# Altium schematic sheet ANALOG_INPUT.SchDoc
size A3; ApprovedBy: D. Grossman; CheckedBy: G. Engel; Author: Y. Yakov; CompanyName: LightSense; DrawnBy: Y. Yakov; Engineer: Y.Yakov; Organization: LightSense
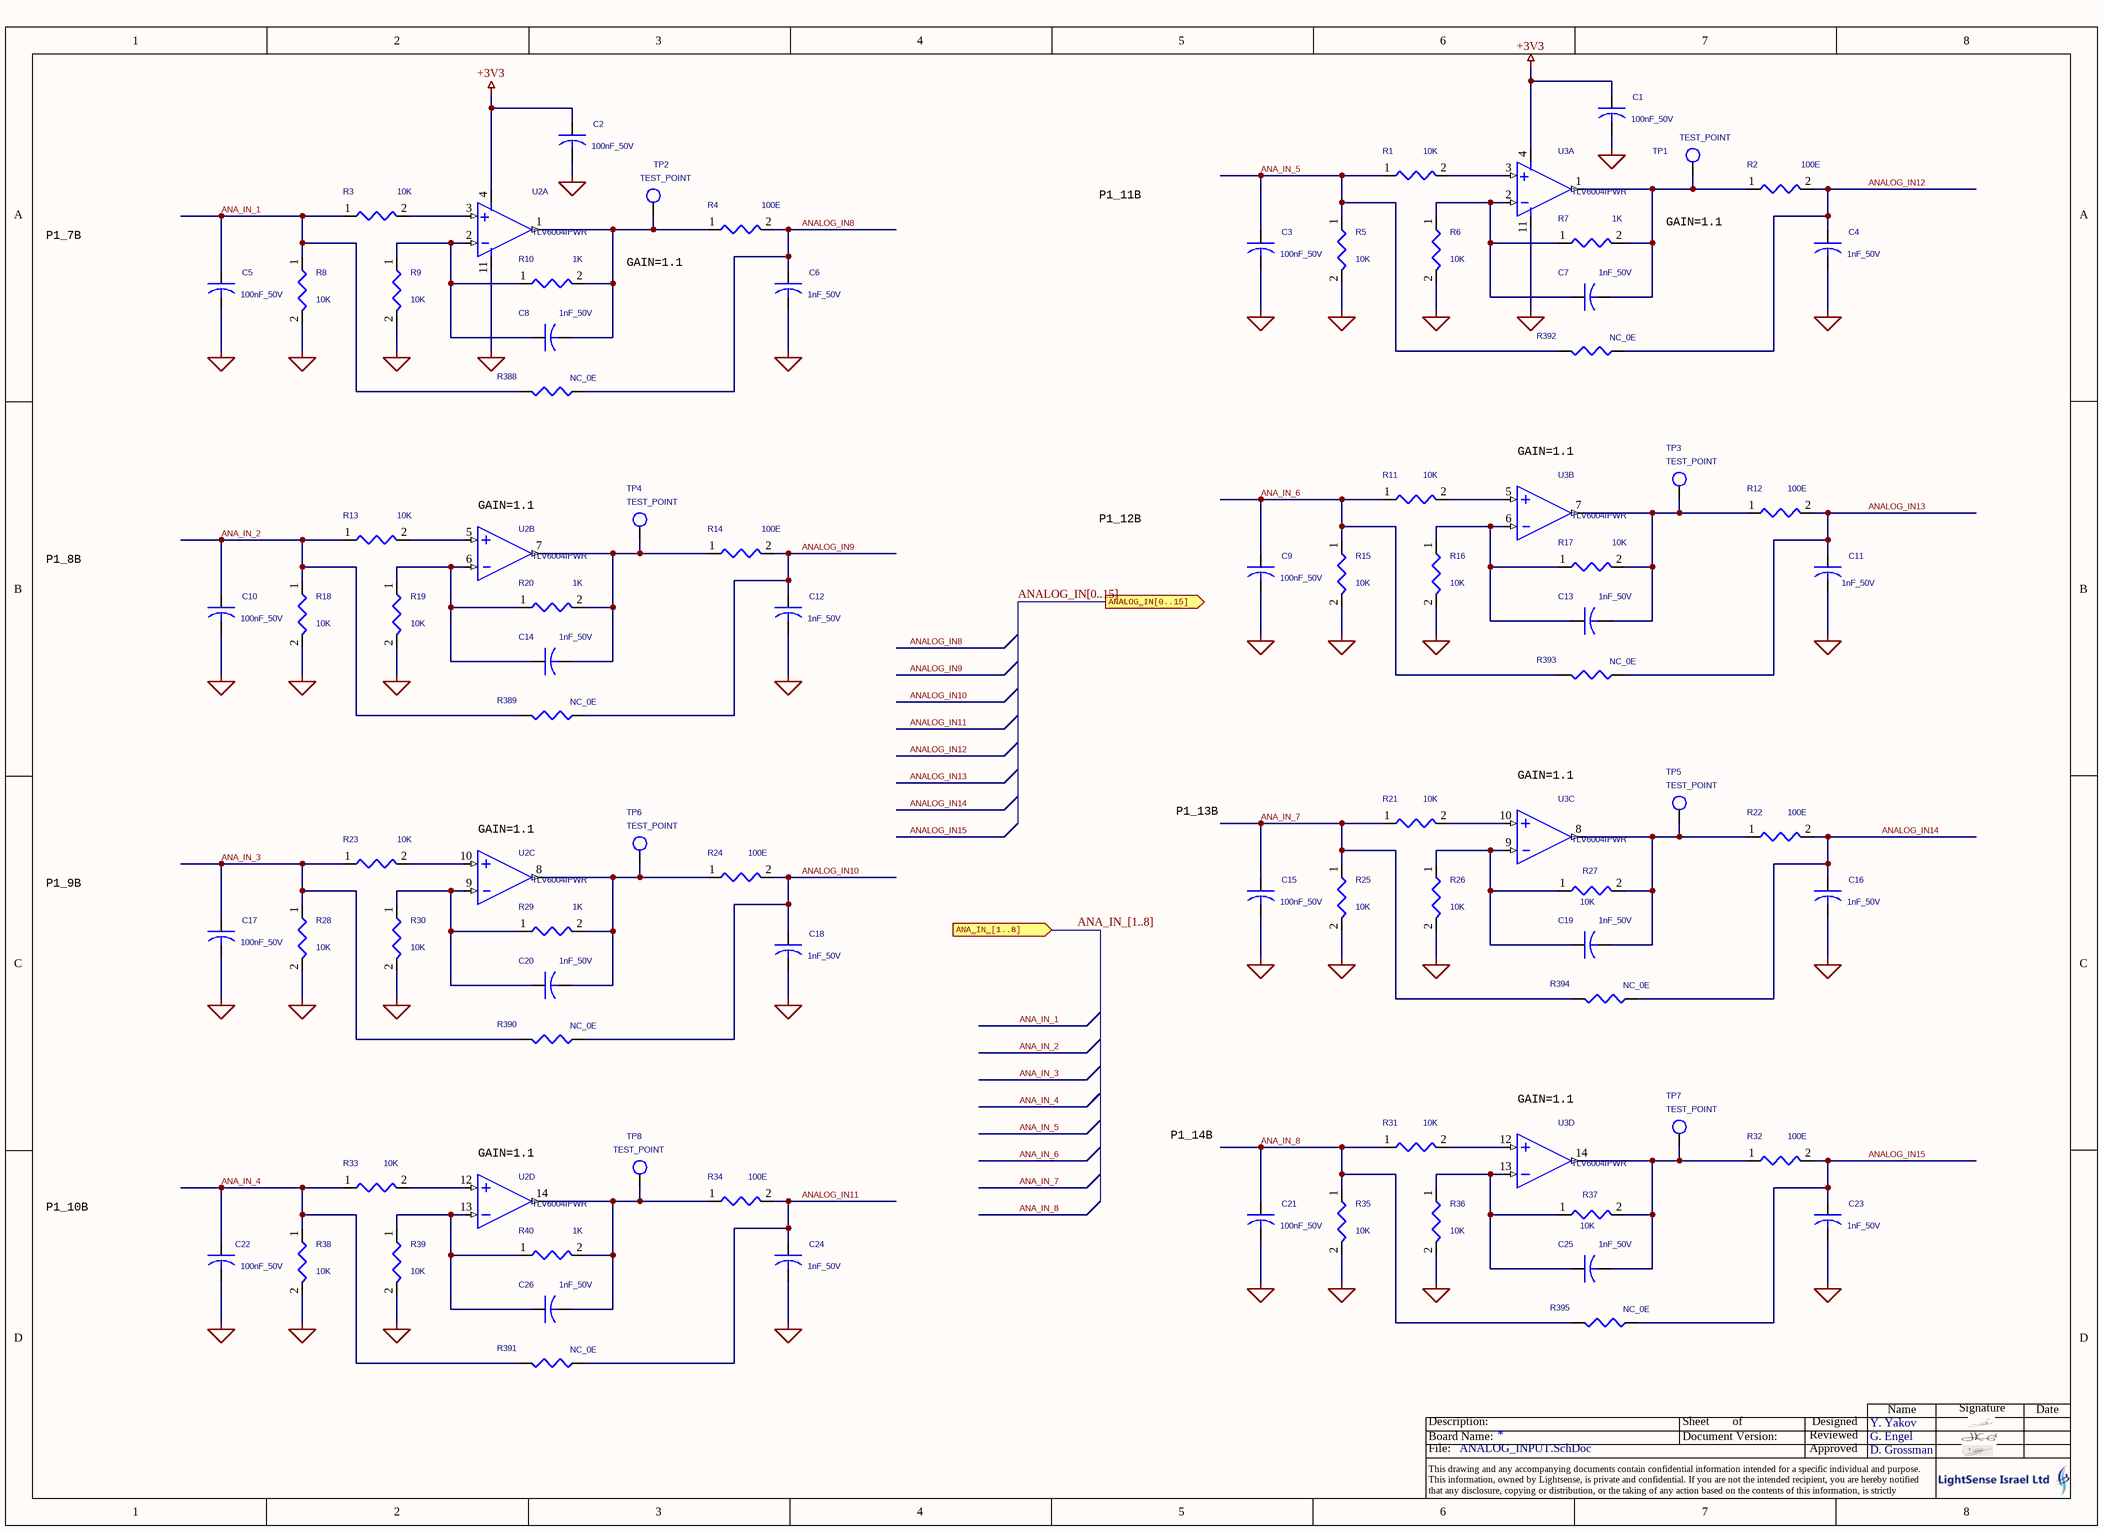
[diagram p0: ANALOG_INPUT.SchDoc]

## Parts
C1  100nF_50V  [0603]
C2  100nF_50V  [0603]
C3  100nF_50V  [0603]
C4  1nF_50V  [0603]
C5  100nF_50V  [0603]
C6  1nF_50V  [0603]
C7  1nF_50V  [0603]
C8  1nF_50V  [0603]
C9  100nF_50V  [0603]
C10  100nF_50V  [0603]
C11  1nF_50V  [0603]
C12  1nF_50V  [0603]
C13  1nF_50V  [0603]
C14  1nF_50V  [0603]
C15  100nF_50V  [0603]
C16  1nF_50V  [0603]
C17  100nF_50V  [0603]
C18  1nF_50V  [0603]
C19  1nF_50V  [0603]
C20  1nF_50V  [0603]
C21  100nF_50V  [0603]
C22  100nF_50V  [0603]
C23  1nF_50V  [0603]
C24  1nF_50V  [0603]
C25  1nF_50V  [0603]
C26  1nF_50V  [0603]
R1  10K  [0603]
R2  100E  [0603]
R3  10K  [0603]
R4  100E  [0603]
R5  10K  [0603]
R6  10K  [0603]
R7  1K  [0603]
R8  10K  [0603]
R9  10K  [0603]
R10  1K  [0603]
R11  10K  [0603]
R12  100E  [0603]
R13  10K  [0603]
R14  100E  [0603]
R15  10K  [0603]
R16  10K  [0603]
R17  10K  [0603]
R18  10K  [0603]
R19  10K  [0603]
R20  1K  [0603]
R21  10K  [0603]
R22  100E  [0603]
R23  10K  [0603]
R24  100E  [0603]
R25  10K  [0603]
R26  10K  [0603]
R27  10K  [0603]
R28  10K  [0603]
R29  1K  [0603]
R30  10K  [0603]
R31  10K  [0603]
R32  100E  [0603]
R33  10K  [0603]
R34  100E  [0603]
R35  10K  [0603]
R36  10K  [0603]
R37  10K  [0603]
R38  10K  [0603]
R39  10K  [0603]
R40  1K  [0603]
R388  NC_0E  [0603]
R389  NC_0E  [0603]
R390  NC_0E  [0603]
R391  NC_0E  [0603]
R392  NC_0E  [0603]
R393  NC_0E  [0603]
R394  NC_0E  [0603]
R395  NC_0E  [0603]
TP1  TEST_POINT  [TH_1mm]
TP2  TEST_POINT  [TH_1mm]
TP3  TEST_POINT  [TH_1mm]
TP4  TEST_POINT  [TH_1mm]
TP5  TEST_POINT  [TH_1mm]
TP6  TEST_POINT  [TH_1mm]
TP7  TEST_POINT  [TH_1mm]
TP8  TEST_POINT  [TH_1mm]
U2  TLV6004IPWR  [TSSOP_14]  (parts A,B,C,D of 4)
U3  TLV6004IPWR  [TSSOP_14]  (parts A,B,C,D of 4)

## Ports
ANA_IN_[1..8] (in), ANALOG_IN[0..15] (out)

## Nets
+3V3: C1.1 C2.1 U2.4(VCC) U3.4(VCC)
AGND: C1.2 C2.2 C3.2 C4.2 C5.2 C6.2 C9.2 C10.2 C11.2 C12.2 C15.2 C16.2 C17.2 C18.2 C21.2 C22.2 C23.2 C24.2 R5.2 R6.2 R8.2 R9.2 R15.2 R16.2 R18.2 R19.2 R25.2 R26.2 R28.2 R30.2 R35.2 R36.2 R38.2 R39.2 U2.11(VEE) U3.11(VEE)
ANA_IN_1: C5.1 R3.1 R8.1 R388.2
ANA_IN_2: C10.1 R13.1 R18.1 R389.2
ANA_IN_3: C17.1 R23.1 R28.1 R390.2
ANA_IN_4: C22.1 R33.1 R38.1 R391.2
ANA_IN_5: C3.1 R1.1 R5.1 R392.2
ANA_IN_6: C9.1 R11.1 R15.1 R393.2
ANA_IN_7: C15.1 R21.1 R25.1 R394.2
ANA_IN_8: C21.1 R31.1 R35.1 R395.2
ANALOG_IN8: C6.1 R4.2 R388.1
ANALOG_IN9: C12.1 R14.2 R389.1
ANALOG_IN10: C18.1 R24.2 R390.1
ANALOG_IN11: C24.1 R34.2 R391.1
ANALOG_IN12: C4.1 R2.2 R392.1
ANALOG_IN13: C11.1 R12.2 R393.1
ANALOG_IN14: C16.1 R22.2 R394.1
ANALOG_IN15: C23.1 R32.2 R395.1
NetC7_1: C7.1 R6.1 R7.1 U3.2(IAN)
NetC7_2: C7.2 R2.1 R7.2 TP1.1(TP) U3.1(OA)
NetC8_1: C8.1 R9.1 R10.1 U2.2(IAN)
NetC8_2: C8.2 R4.1 R10.2 TP2.1(TP) U2.1(OA)
NetC13_1: C13.1 R16.1 R17.1 U3.6(IBN)
NetC13_2: C13.2 R12.1 R17.2 TP3.1(TP) U3.7(OB)
NetC14_1: C14.1 R19.1 R20.1 U2.6(IBN)
NetC14_2: C14.2 R14.1 R20.2 TP4.1(TP) U2.7(OB)
NetC19_1: C19.1 R26.1 R27.1 U3.9(ICN)
NetC19_2: C19.2 R22.1 R27.2 TP5.1(TP) U3.8(OC)
NetC20_1: C20.1 R29.1 R30.1 U2.9(ICN)
NetC20_2: C20.2 R24.1 R29.2 TP6.1(TP) U2.8(OC)
NetC25_1: C25.1 R36.1 R37.1 U3.13(IDN)
NetC25_2: C25.2 R32.1 R37.2 TP7.1(TP) U3.14(OD)
NetC26_1: C26.1 R39.1 R40.1 U2.13(IDN)
NetC26_2: C26.2 R34.1 R40.2 TP8.1(TP) U2.14(OD)
NetR1_2: R1.2 U3.3(IAP)
NetR3_2: R3.2 U2.3(IAP)
NetR11_2: R11.2 U3.5(IBP)
NetR13_2: R13.2 U2.5(IBP)
NetR21_2: R21.2 U3.10(ICP)
NetR23_2: R23.2 U2.10(ICP)
NetR31_2: R31.2 U3.12(IDP)
NetR33_2: R33.2 U2.12(IDP)

## Buses and harness runs
bus ANA_IN_[1..8] = port ANA_IN_[1..8]
bus ANALOG_IN[0..15] = port ANALOG_IN[0..15]

## Notes on the sheet
- P1_11B
- P1_7B
- GAIN=1.1
- (near U3) GAIN=1.1
- (near U2) GAIN=1.1
- P1_12B
- P1_8B
- P1_13B
- P1_9B
- P1_14B
- P1_10B
- Name
- Signature
- Date
- File:
- Board Name:
- Description:
- Document Version:
- Sheet
- of
- Approved
- Reviewed
- Designed
- This drawing and any accompanying documents contain confidential information intended for a specific individual and purpose.
  This information, owned by Lightsense, is private and confidential. If you are not the intended recipient, you are hereby notified that any disclosure, copying or distribution, or the taking of any action based on the contents of this information, is strictly prohibited.

## Library data of the parts
C1 C5 C22 = C: CAP_SMT_0603_50V_X7R_10%; MFG: KEMET; MFG_PN: C0603C104K5RAC
C2 C3 C9 C10 C15 C17 C21 = C: CAP_SMT_0603_50V_X7R_10%; MFG_PN: C0603C104K5RAC; MFG: KEMET
C4 C6-C8 C12 C13 C16 C19 C20 C23-C25 = C: CAP_SMT_0603_50V_X7R_10%; MFG: KEMET; MFG_PN: C0603C102K5RAC
C11 C14 C18 C26 = C: CAP_SMT_0603_50V_X7R_10%; MFG_PN: C0603C102K5RAC; MFG: KEMET
R1-R26 R28-R36 R38-R40 = R_Dup2: MFG: YAGEO; MFG_PN: RC0603FR-07  KL
R27 R37 = R_Dup2: MFG_PN: RC0603FR-07  KL; MFG: YAGEO
R388 R390 R391 R394 R395 = R_Dup1: MFG_PN: RC0603FR-070R00L; MFG: YAGEO
R389 R392 R393 = R_Dup1: MFG: YAGEO; MFG_PN: RC0603FR-070R00L
TP1-TP8 = T POINT R_Dup1
U2 U3 = TL6004IP: OP_AMP; MFG: TI; MFG_PN: TLV6004IPWR